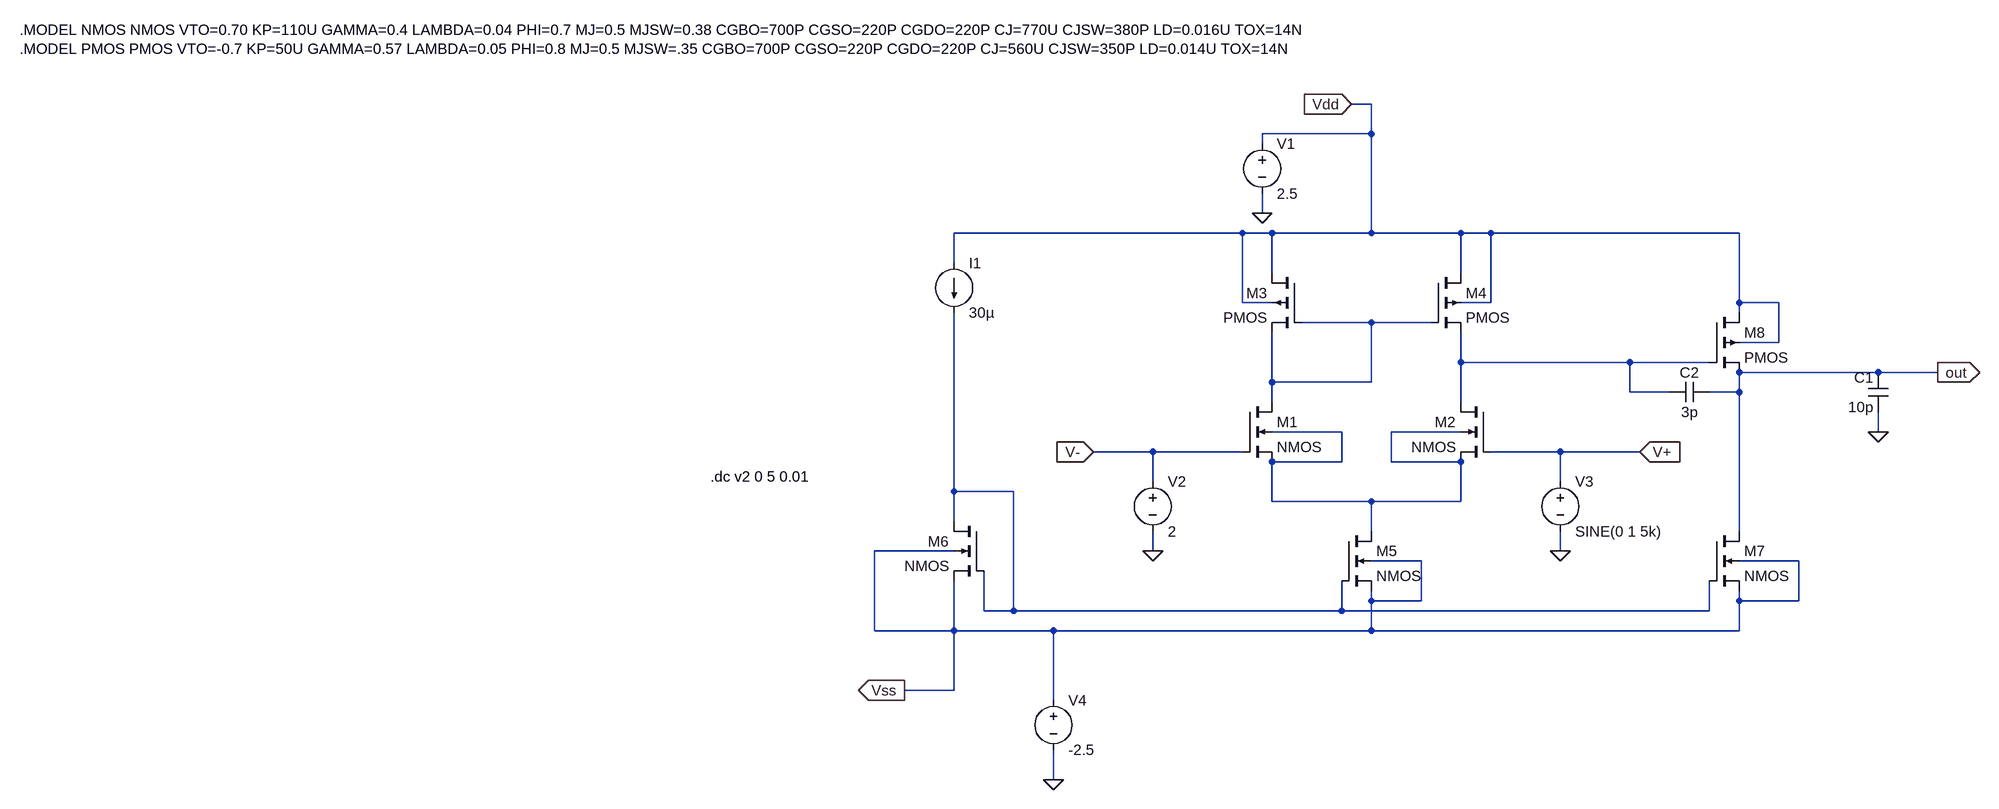
[diagram p0: schematic Draft2.asc]
Draft2.asc, the LTspice schematic file:
Version 4
SHEET 1 1728 788
WIRE 720 -320 688 -320
WIRE 720 -272 720 -320
WIRE 720 -272 544 -272
WIRE 544 -256 544 -272
WIRE 544 -144 544 -176
WIRE 512 -112 48 -112
WIRE 560 -112 512 -112
WIRE 720 -112 720 -272
WIRE 720 -112 560 -112
WIRE 864 -112 720 -112
WIRE 912 -112 864 -112
WIRE 1312 -112 912 -112
WIRE 48 -64 48 -112
WIRE 560 -48 560 -112
WIRE 864 -48 864 -112
WIRE 512 0 512 -112
WIRE 560 0 512 0
WIRE 912 0 912 -112
WIRE 912 0 864 0
WIRE 1312 0 1312 -112
WIRE 1376 0 1312 0
WIRE 1312 16 1312 0
WIRE 720 32 608 32
WIRE 816 32 720 32
WIRE 1376 64 1376 0
WIRE 1376 64 1312 64
WIRE 864 96 864 48
WIRE 1136 96 864 96
WIRE 1264 96 1136 96
WIRE 1536 112 1312 112
WIRE 1632 112 1536 112
WIRE 560 128 560 48
WIRE 720 128 720 32
WIRE 720 128 560 128
WIRE 1136 144 1136 96
WIRE 1200 144 1136 144
WIRE 1312 144 1312 112
WIRE 1312 144 1264 144
WIRE 560 160 560 128
WIRE 864 160 864 96
WIRE 672 208 560 208
WIRE 864 208 752 208
WIRE 1536 208 1536 176
WIRE 368 240 272 240
WIRE 512 240 368 240
WIRE 1024 240 912 240
WIRE 1152 240 1024 240
WIRE 672 256 672 208
WIRE 672 256 560 256
WIRE 752 256 752 208
WIRE 864 256 752 256
WIRE 368 288 368 240
WIRE 1024 288 1024 240
WIRE 48 304 48 16
WIRE 144 304 48 304
WIRE 560 320 560 256
WIRE 720 320 560 320
WIRE 864 320 864 256
WIRE 864 320 720 320
WIRE 48 352 48 304
WIRE 720 368 720 320
WIRE 1312 368 1312 144
WIRE 48 400 -80 400
WIRE 368 400 368 368
WIRE 1024 400 1024 368
WIRE 800 416 720 416
WIRE 1408 416 1312 416
WIRE 720 480 720 464
WIRE 800 480 800 416
WIRE 800 480 720 480
WIRE 1312 480 1312 464
WIRE 1408 480 1408 416
WIRE 1408 480 1312 480
WIRE 96 496 96 432
WIRE 144 496 144 304
WIRE 144 496 96 496
WIRE 672 496 672 448
WIRE 672 496 144 496
WIRE 1264 496 1264 448
WIRE 1264 496 672 496
WIRE -80 528 -80 400
WIRE 48 528 48 448
WIRE 48 528 -80 528
WIRE 208 528 48 528
WIRE 720 528 720 480
WIRE 720 528 208 528
WIRE 1312 528 1312 480
WIRE 1312 528 720 528
WIRE 48 624 48 528
WIRE 48 624 -32 624
WIRE 208 640 208 528
WIRE 208 768 208 720
FLAG 1536 208 0
FLAG 1632 112 out
IOPIN 1632 112 Out
FLAG 688 -320 Vdd
IOPIN 688 -320 In
FLAG 272 240 V-
IOPIN 272 240 In
FLAG 1152 240 V+
IOPIN 1152 240 In
FLAG -32 624 Vss
IOPIN -32 624 Out
FLAG 544 -144 0
FLAG 368 400 0
FLAG 1024 400 0
FLAG 208 768 0
SYMBOL nmos4 512 160 R0
SYMATTR InstName M1
SYMATTR Value2 l=1u w=3u
SYMBOL nmos4 912 160 M0
SYMATTR InstName M2
SYMATTR Value2 l=1u w=3u
SYMBOL pmos4 608 -48 M0
SYMATTR InstName M3
SYMATTR Value2 l=1u w=11u
SYMBOL pmos4 816 -48 R0
SYMATTR InstName M4
SYMATTR Value2 l=1u w=11u
SYMBOL nmos4 672 368 R0
SYMATTR InstName M5
SYMATTR Value2 l=1u w=2u
SYMBOL cap 1552 176 R180
WINDOW 0 24 56 Left 2
WINDOW 3 24 8 Left 2
SYMATTR InstName C1
SYMATTR Value 10p
SYMBOL current 48 -64 R0
WINDOW 123 0 0 Left 0
WINDOW 39 0 0 Left 0
SYMATTR InstName I1
SYMATTR Value 30µ
SYMBOL nmos4 96 352 M0
SYMATTR InstName M6
SYMATTR Value2 l=1u w=2u
SYMBOL nmos4 1264 368 R0
SYMATTR InstName M7
SYMATTR Value2 l=1u w=8u
SYMBOL pmos4 1264 16 R0
SYMATTR InstName M8
SYMATTR Value2 l=1u w=86u
SYMBOL cap 1264 128 R90
WINDOW 0 0 32 VBottom 2
WINDOW 3 32 32 VTop 2
SYMATTR InstName C2
SYMATTR Value 3p
SYMBOL voltage 544 -272 R0
WINDOW 123 0 0 Left 0
WINDOW 39 0 0 Left 0
SYMATTR InstName V1
SYMATTR Value 2.5
SYMBOL voltage 368 272 R0
WINDOW 123 0 0 Left 0
WINDOW 39 0 0 Left 0
SYMATTR InstName V2
SYMATTR Value 2
SYMBOL voltage 1024 272 R0
WINDOW 123 0 0 Left 0
WINDOW 39 0 0 Left 0
SYMATTR InstName V3
SYMATTR Value SINE(0 1 5k)
SYMBOL voltage 208 624 R0
WINDOW 123 0 0 Left 0
WINDOW 39 0 0 Left 0
SYMATTR InstName V4
SYMATTR Value -2.5
TEXT -1456 -440 Left 2 !.MODEL NMOS NMOS VTO=0.70 KP=110U GAMMA=0.4 LAMBDA=0.04 PHI=0.7 MJ=0.5 MJSW=0.38 CGBO=700P CGSO=220P CGDO=220P CJ=770U CJSW=380P LD=0.016U TOX=14N\n.MODEL PMOS PMOS VTO=-0.7 KP=50U GAMMA=0.57 LAMBDA=0.05 PHI=0.8 MJ=0.5 MJSW=.35 CGBO=700P CGSO=220P CGDO=220P CJ=560U CJSW=350P LD=0.014U TOX=14N
TEXT -344 280 Left 2 !.dc v2 0 5 0.01

The netlist it stands for:
* Draft2.asc
M1 N001 V- N003 N003 NMOS l=1u w=3u
M2 N002 V+ N003 N003 NMOS l=1u w=3u
M3 Vdd N001 N001 Vdd PMOS l=1u w=11u
M4 Vdd N001 N002 Vdd PMOS l=1u w=11u
M5 N003 N004 Vss Vss NMOS l=1u w=2u
C1 0 out 10p
I1 Vdd N004 30µ
M6 N004 N004 Vss Vss NMOS l=1u w=2u
M7 out N004 Vss Vss NMOS l=1u w=8u
M8 Vdd N002 out Vdd PMOS l=1u w=86u
C2 out N002 3p
V1 Vdd 0 2.5
V2 V- 0 2
V3 V+ 0 SINE(0 1 5k)
V4 Vss 0 -2.5
.model NMOS NMOS
.model PMOS PMOS
.lib standard.mos
.MODEL NMOS NMOS VTO=0.70 KP=110U GAMMA=0.4 LAMBDA=0.04 PHI=0.7 MJ=0.5 MJSW=0.38 CGBO=700P CGSO=220P CGDO=220P CJ=770U CJSW=380P LD=0.016U TOX=14N
.MODEL PMOS PMOS VTO=-0.7 KP=50U GAMMA=0.57 LAMBDA=0.05 PHI=0.8 MJ=0.5 MJSW=.35 CGBO=700P CGSO=220P CGDO=220P CJ=560U CJSW=350P LD=0.014U TOX=14N
.dc v2 0 5 0.01
.backanno
.end

* Results of the author's LTspice run, read from the files saved beside the schematic
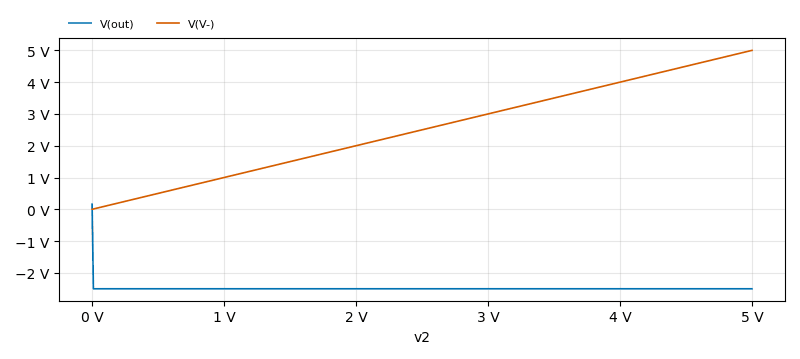
[diagram p1: DC transfer characteristic of Draft2.asc, plotted from the saved traces]
* DC transfer characteristic, 1 run:
*   V(out): 161.6 mV at v2=0 V, -2.5 V at v2=5 V, min -2.501 V, max 161.6 mV
*   V(V-): 0 V at v2=0 V, 5 V at v2=5 V, min 0 V, max 5 V